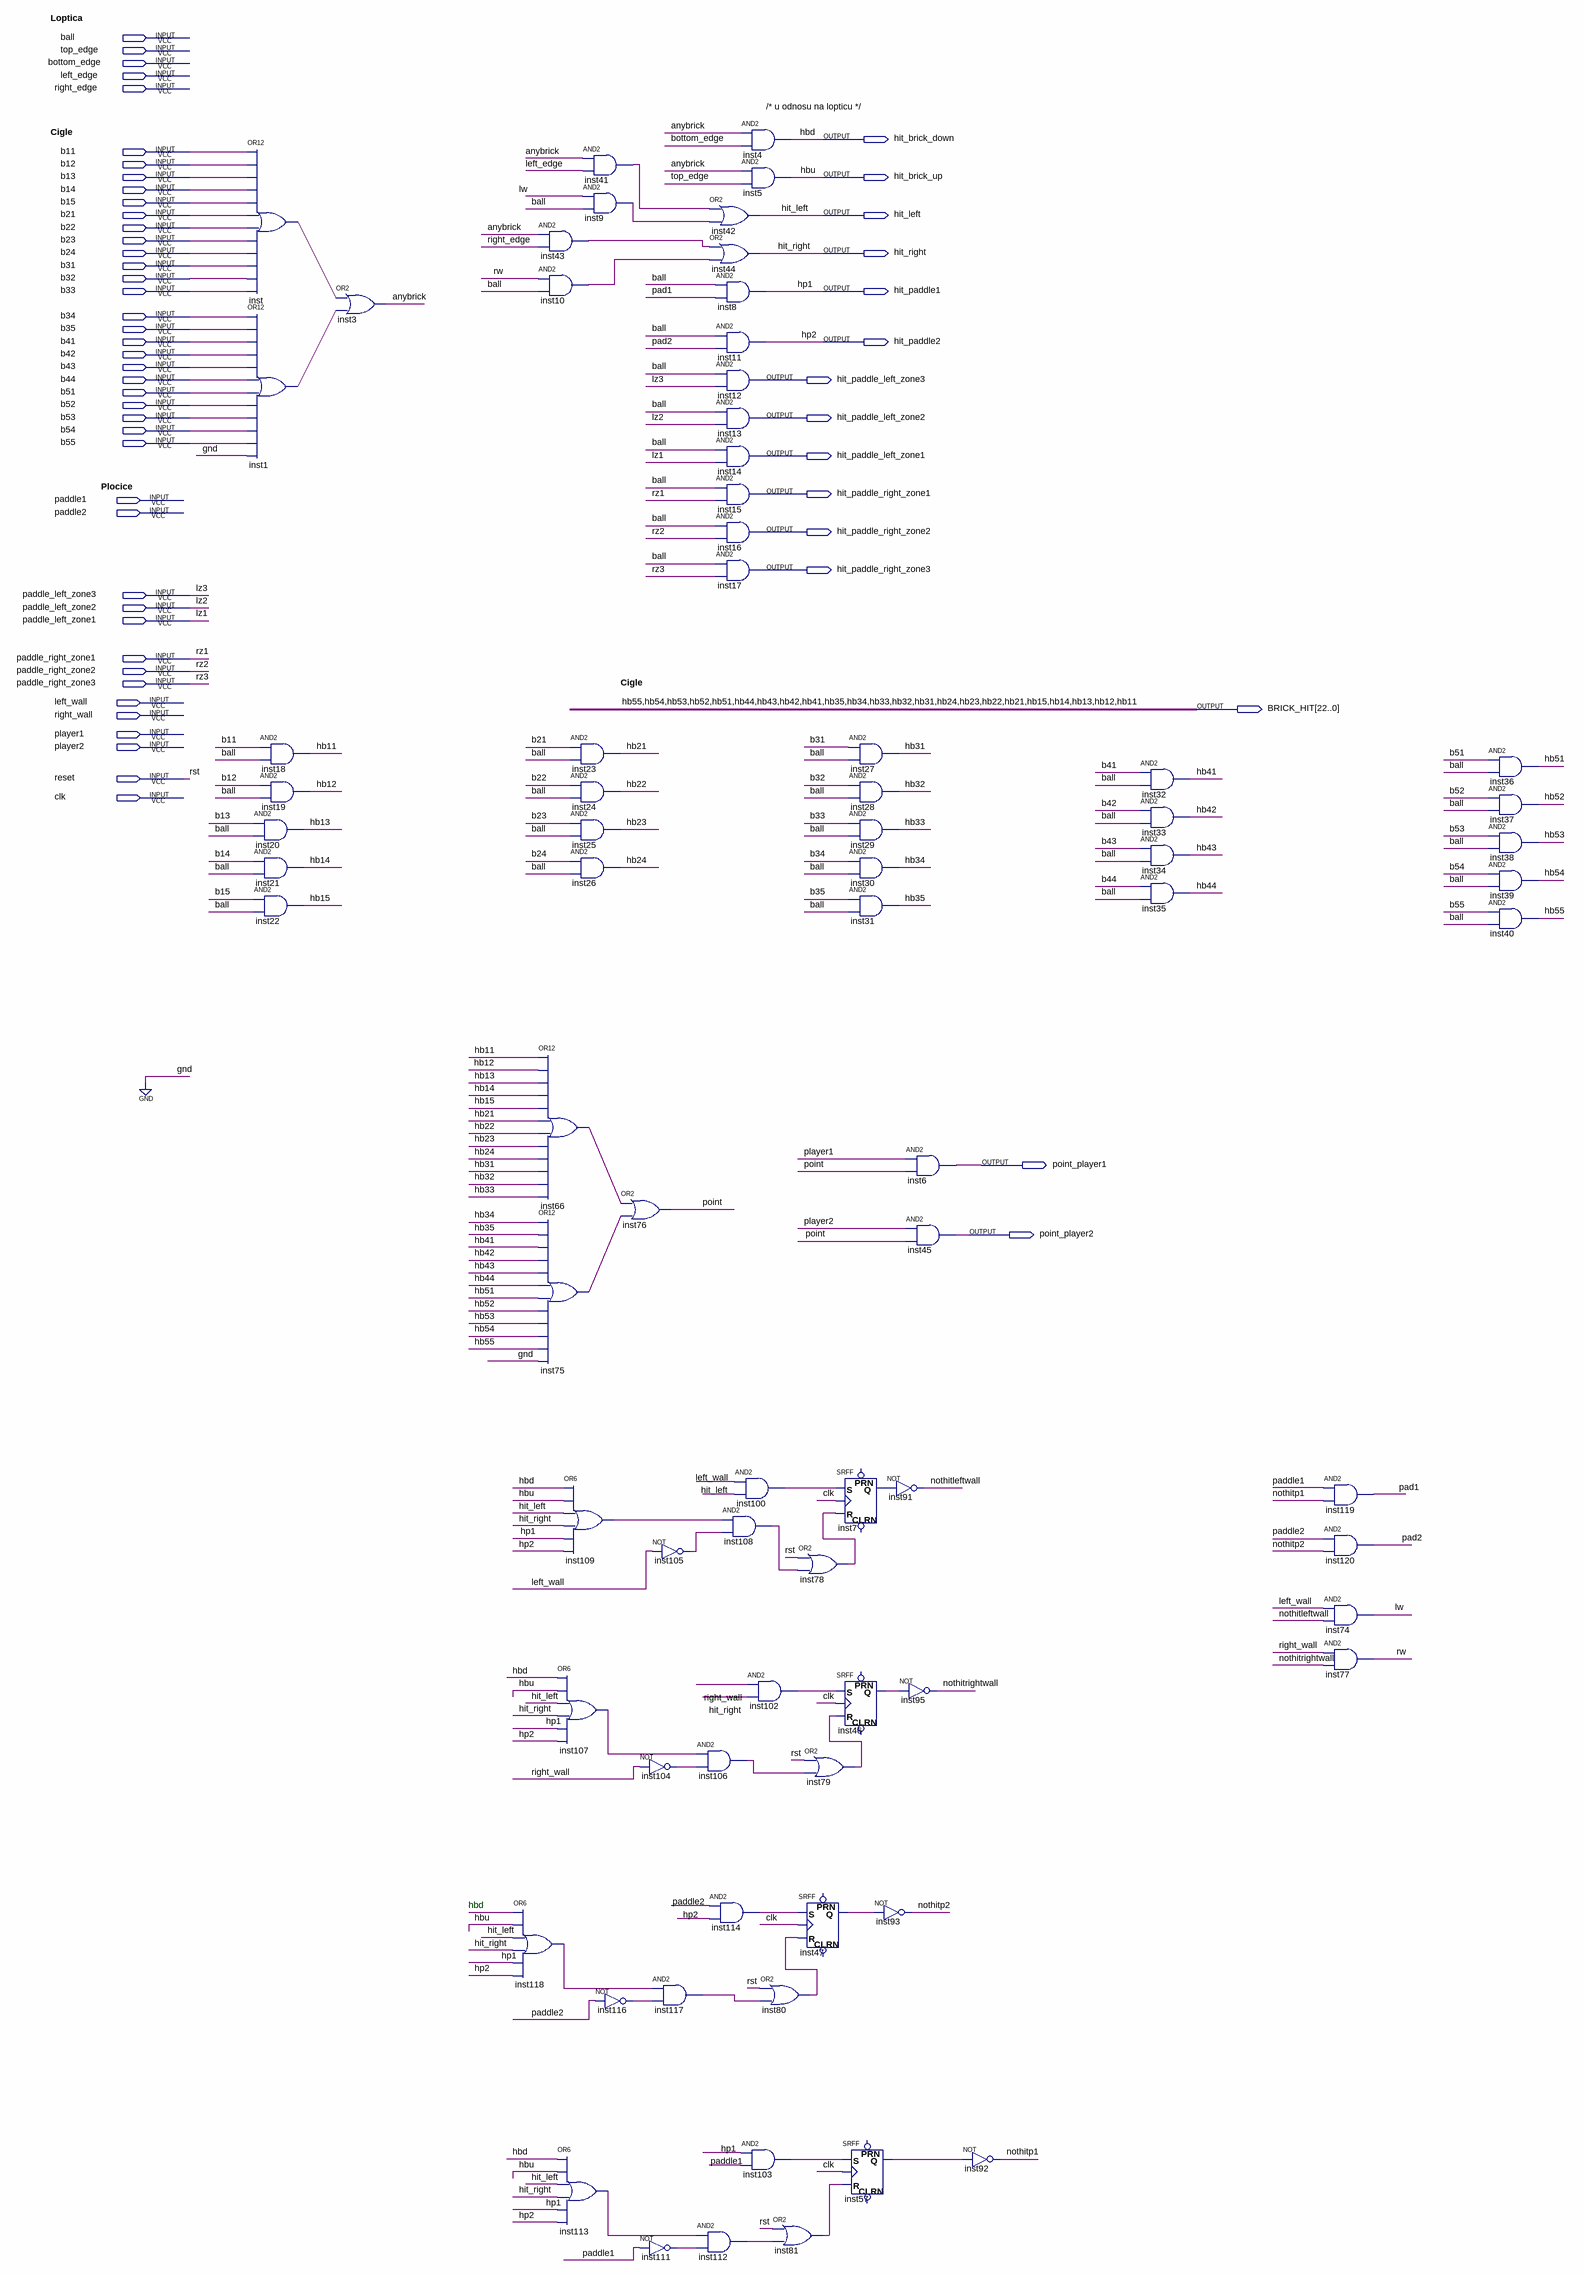
[diagram p0: schematic sheet]
// Quartus schematic collision.bdf as structural Verilog: 79 symbols, 57 pins
module collision (
  input  ball,
  input  top_edge,
  input  bottom_edge,
  input  left_edge,
  input  right_edge,
  input  b11,
  input  b12,
  input  b13,
  input  b14,
  input  b15,
  input  b21,
  input  b22,
  input  b23,
  input  b24,
  input  b31,
  input  b32,
  input  b33,
  input  b34,
  input  b35,
  input  b41,
  input  b42,
  input  b43,
  input  b44,
  input  b51,
  input  b52,
  input  b53,
  input  b54,
  input  b55,
  input  paddle1,
  input  paddle2,
  input  paddle_left_zone3,
  input  paddle_left_zone2,
  input  paddle_left_zone1,
  input  paddle_right_zone1,
  input  paddle_right_zone2,
  input  paddle_right_zone3,
  input  left_wall,
  input  right_wall,
  input  player1,
  input  player2,
  input  reset,
  input  clk,
  output hit_brick_down,
  output hit_brick_up,
  output hit_left,
  output hit_right,
  output hit_paddle1,
  output hit_paddle2,
  output hit_paddle_left_zone3,
  output hit_paddle_left_zone2,
  output hit_paddle_left_zone1,
  output hit_paddle_right_zone1,
  output hit_paddle_right_zone2,
  output hit_paddle_right_zone3,
  output [22:0] BRICK_HIT,
  output point_player1,
  output point_player2
);

  wire anybrick, inst1_out, inst7_q, inst9_out, inst10_out, inst41_out, inst43_out, inst46_q, inst47_q,
       inst57_q, inst66_out, inst75_out, inst78_out, inst79_out, inst80_out, inst81_out, inst100_out,
       inst102_out, inst103_out, inst104_out, inst105_out, inst106_out, inst107_out, inst108_out,
       inst109_out, inst111_out, inst112_out, inst113_out, inst114_out, inst116_out, inst117_out,
       inst118_out, inst_out, lw, nothitleftwall, nothitp1, nothitp2, nothitrightwall, pad1, pad2, point, rw;

  or inst (inst_out, b11, b12, b13, b14, b15, b21, b22, b23, b24, b31, b32, b33);
  or inst1 (inst1_out, b34, b35, b41, b42, b43, b44, b51, b52, b53, b54, b55, 1'b0);
  and inst18 (BRICK_HIT[0], b11, ball);
  and inst19 (BRICK_HIT[1], b12, ball);
  and inst20 (BRICK_HIT[2], b13, ball);
  and inst21 (BRICK_HIT[3], b14, ball);
  and inst22 (BRICK_HIT[4], b15, ball);
  or inst3 (anybrick, inst_out, inst1_out);
  or inst118 (inst118_out, hit_brick_down, hit_brick_up, hit_left, hit_right, hit_paddle1, hit_paddle2);
  and inst43 (inst43_out, anybrick, right_edge);
  and inst10 (inst10_out, rw, ball);
  or inst66 (inst66_out, BRICK_HIT[0], BRICK_HIT[1], BRICK_HIT[2], BRICK_HIT[3], BRICK_HIT[4], BRICK_HIT[5], BRICK_HIT[6], BRICK_HIT[7], BRICK_HIT[8], BRICK_HIT[9], BRICK_HIT[10], BRICK_HIT[11]);
  or inst75 (inst75_out, BRICK_HIT[12], BRICK_HIT[13], BRICK_HIT[14], BRICK_HIT[15], BRICK_HIT[16], BRICK_HIT[17], BRICK_HIT[18], BRICK_HIT[19], BRICK_HIT[20], BRICK_HIT[21], BRICK_HIT[22], 1'b0);
  or inst109 (inst109_out, hit_brick_down, hit_brick_up, hit_left, hit_right, hit_paddle1, hit_paddle2);
  or inst107 (inst107_out, hit_brick_down, hit_brick_up, hit_left, hit_right, hit_paddle1, hit_paddle2);
  or inst113 (inst113_out, hit_brick_down, hit_brick_up, hit_left, hit_right, hit_paddle1, hit_paddle2);
  and inst41 (inst41_out, anybrick, left_edge);
  and inst9 (inst9_out, lw, ball);
  and inst23 (BRICK_HIT[5], b21, ball);
  and inst24 (BRICK_HIT[6], b22, ball);
  and inst25 (BRICK_HIT[7], b23, ball);
  and inst26 (BRICK_HIT[8], b24, ball);
  not inst116 (inst116_out, paddle2);
  or inst76 (point, inst66_out, inst75_out);
  not inst105 (inst105_out, left_wall);
  not inst104 (inst104_out, right_wall);
  and inst117 (inst117_out, inst118_out, inst116_out);
  not inst111 (inst111_out, paddle1);
  or inst42 (hit_left, inst41_out, inst9_out);
  or inst44 (hit_right, inst43_out, inst10_out);
  and inst8 (hit_paddle1, ball, pad1);
  and inst11 (hit_paddle2, ball, pad2);
  and inst12 (hit_paddle_left_zone3, ball, paddle_left_zone3);
  and inst13 (hit_paddle_left_zone2, ball, paddle_left_zone2);
  and inst14 (hit_paddle_left_zone1, ball, paddle_left_zone1);
  and inst15 (hit_paddle_right_zone1, ball, paddle_right_zone1);
  and inst16 (hit_paddle_right_zone2, ball, paddle_right_zone2);
  and inst17 (hit_paddle_right_zone3, ball, paddle_right_zone3);
  and inst106 (inst106_out, inst107_out, inst104_out);
  and inst114 (inst114_out, paddle2, hit_paddle2);
  and inst112 (inst112_out, inst113_out, inst111_out);
  and inst4 (hit_brick_down, anybrick, bottom_edge);
  and inst5 (hit_brick_up, anybrick, top_edge);
  and inst100 (inst100_out, left_wall, hit_left);
  and inst108 (inst108_out, inst109_out, inst105_out);
  and inst102 (inst102_out, right_wall, hit_right);
  or inst80 (inst80_out, reset, inst117_out);
  and inst103 (inst103_out, paddle1, hit_paddle1);
  or inst78 (inst78_out, reset, inst108_out);
  or inst79 (inst79_out, reset, inst106_out);
  SRFF inst47 (.S(inst114_out), .R(inst80_out), .CLK(clk), .Q(inst47_q));  // open: PRN, CLRN
  or inst81 (inst81_out, reset, inst112_out);
  and inst27 (BRICK_HIT[9], b31, ball);
  and inst28 (BRICK_HIT[10], b32, ball);
  and inst29 (BRICK_HIT[11], b33, ball);
  and inst30 (BRICK_HIT[12], b34, ball);
  and inst31 (BRICK_HIT[13], b35, ball);
  SRFF inst7 (.S(inst100_out), .R(inst78_out), .CLK(clk), .Q(inst7_q));  // open: PRN, CLRN
  SRFF inst46 (.S(inst102_out), .R(inst79_out), .CLK(clk), .Q(inst46_q));  // open: PRN, CLRN
  SRFF inst57 (.S(inst103_out), .R(inst81_out), .CLK(clk), .Q(inst57_q));  // open: PRN, CLRN
  and inst6 (point_player1, player1, point);
  and inst45 (point_player2, player2, point);
  not inst91 (nothitleftwall, inst7_q);
  not inst95 (nothitrightwall, inst46_q);
  not inst93 (nothitp2, inst47_q);
  not inst92 (nothitp1, inst57_q);
  and inst32 (BRICK_HIT[14], b41, ball);
  and inst33 (BRICK_HIT[15], b42, ball);
  and inst34 (BRICK_HIT[16], b43, ball);
  and inst35 (BRICK_HIT[17], b44, ball);
  and inst119 (pad1, paddle1, nothitp1);
  and inst120 (pad2, paddle2, nothitp2);
  and inst74 (lw, left_wall, nothitleftwall);
  and inst77 (rw, right_wall, nothitrightwall);
  and inst36 (BRICK_HIT[18], b51, ball);
  and inst37 (BRICK_HIT[19], b52, ball);
  and inst38 (BRICK_HIT[20], b53, ball);
  and inst39 (BRICK_HIT[21], b54, ball);
  and inst40 (BRICK_HIT[22], b55, ball);

  // Other names for the same wires on the sheet: hb11 = BRICK_HIT[0]; hb12 = BRICK_HIT[1]; hb13 = BRICK_HIT[2];
  //   hb14 = BRICK_HIT[3]; hb15 = BRICK_HIT[4]; hb21 = BRICK_HIT[5]; hb22 = BRICK_HIT[6]; hb23 = BRICK_HIT[7];
  //   hb24 = BRICK_HIT[8]; hb31 = BRICK_HIT[9]; hb32 = BRICK_HIT[10]; hb33 = BRICK_HIT[11]; hb34 = BRICK_HIT[12];
  //   hb35 = BRICK_HIT[13]; hb41 = BRICK_HIT[14]; hb42 = BRICK_HIT[15]; hb43 = BRICK_HIT[16]; hb44 = BRICK_HIT[17];
  //   hb51 = BRICK_HIT[18]; hb52 = BRICK_HIT[19]; hb53 = BRICK_HIT[20]; hb54 = BRICK_HIT[21]; hb55 = BRICK_HIT[22];
  //   hbd = hit_brick_down; hbu = hit_brick_up; hp1 = hit_paddle1; hp2 = hit_paddle2; lz1 = paddle_left_zone1;
  //   lz2 = paddle_left_zone2; lz3 = paddle_left_zone3; rst = reset; rz1 = paddle_right_zone1;
  //   rz2 = paddle_right_zone2; rz3 = paddle_right_zone3

  // Notes on the sheet:
  //   Loptica
  //   /* u odnosu na lopticu */
  //   Cigle
  //   Plocice
  //   Cigle
  //   hbd
endmodule
